# Altium schematic sheet Main_Schematic.SchDoc
size A2
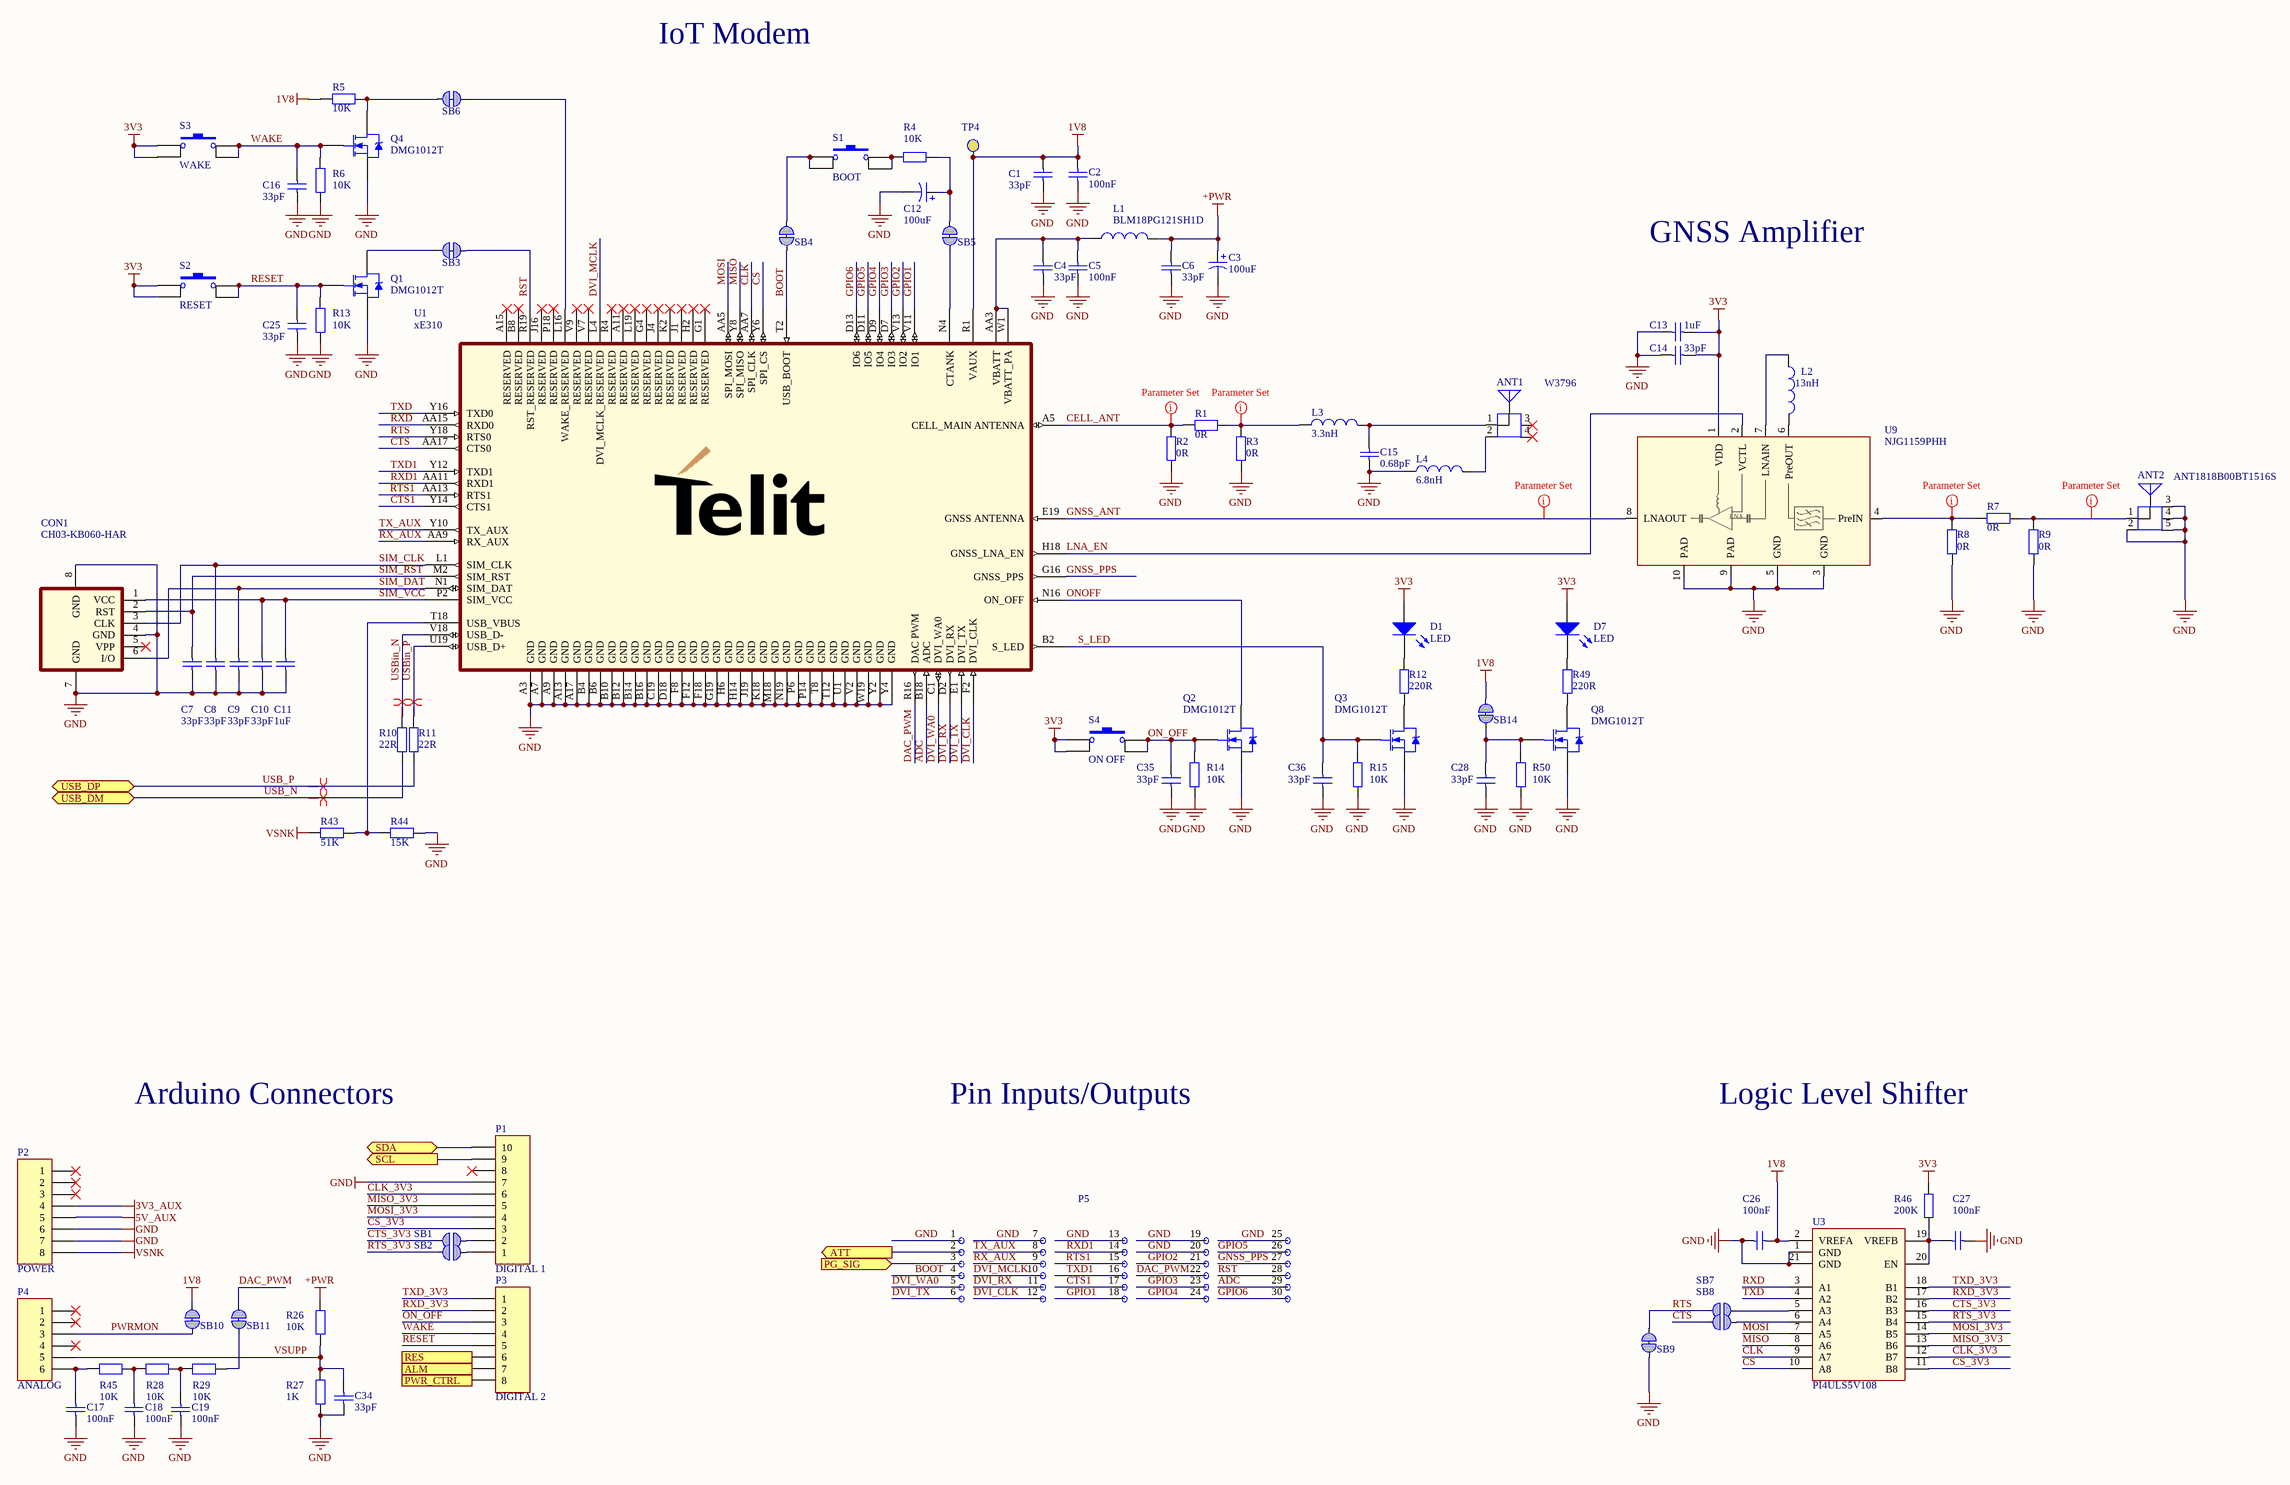
[diagram p0: Main_Schematic.SchDoc]

## Parts
ANT1  W3796  [W3796]
ANT2  ANT1818B00BT1516S  [ANT1818B00BT1516S]
C1  value 33pF  [C0402]  (hidden comment: Cap Semi)
C2  value 100nF  [C0402]  (hidden comment: Cap Semi)
C3  value 100uF  [Case-B]  (hidden comment: electrolytic capacitor)
C4  value 33pF  [C0402]  (hidden comment: Cap Semi)
C5  value 100nF  [C0402]  (hidden comment: Cap Semi)
C6  value 33pF  [C0402]  (hidden comment: Cap Semi)
C7  value 33pF  [C0402]  (hidden comment: Cap Semi)
C8  value 33pF  [C0402]  (hidden comment: Cap Semi)
C9  value 33pF  [C0402]  (hidden comment: Cap Semi)
C10  value 33pF  [C0402]  (hidden comment: Cap Semi)
C11  value 1uF  [C0402]  (hidden comment: Cap Semi)
C12  value 100uF  [Case-B]  (hidden comment: electrolytic capacitor)
C13  value 1uF  [C0402]  (hidden comment: Cap Semi)
C14  value 33pF  [C0402]  (hidden comment: Cap Semi)
C15  value 0.68pF  [C0402]  (hidden comment: Cap Semi)
C16  value 33pF  [C0402]  (hidden comment: Cap Semi)
C17  value 100nF  [C0402]  (hidden comment: Cap Semi)
C18  value 100nF  [C0402]  (hidden comment: Cap Semi)
C19  value 100nF  [C0402]  (hidden comment: Cap Semi)
C25  value 33pF  [C0402]  (hidden comment: Cap Semi)
C26  value 100nF  [C0402]  (hidden comment: Cap Semi)
C27  value 100nF  [C0402]  (hidden comment: Cap Semi)
C28  value 33pF  [C0402]  (hidden comment: Cap Semi)
C34  value 33pF  [C0402]  (hidden comment: Cap Semi)
C35  value 33pF  [C0402]  (hidden comment: Cap Semi)
C36  value 33pF  [C0402]  (hidden comment: Cap Semi)
CON1  CH03-KB060-HAR  [CH03-KB]
D1  LED  [PICOLED]
D7  LED  [PICOLED]
L1  value BLM18PG121SH1D  [L0603]  (hidden comment: Inductor)
L2  value 13nH  [L0402]  (hidden comment: Inductor)
L3  value 3.3nH  [L0603]  (hidden comment: Inductor)
L4  value 6.8nH  [L0603]  (hidden comment: Inductor)
P1  DIGITAL 1  [HDR1X10]
P2  POWER  [HDR1X8]  (no BOM)
P3  DIGITAL 2  [HDR1X8]  (no BOM)
P4  ANALOG  [HDR1X6]  (no BOM)
P5  THT_Matrix  [THT_Matrix_5x6]  (value not drawn)  (no BOM)
Q1  DMG1012T  [SOT-523_custom]
Q2  DMG1012T  [SOT-523_custom]
Q3  DMG1012T  [SOT-523_custom]
Q4  DMG1012T  [SOT-523_custom]
Q8  DMG1012T  [SOT-523_custom]
R1  value 0R  [R0402]  (hidden comment: Res2)
R2  value 0R  [R0402]  (hidden comment: Res2)
R3  value 0R  [R0402]  (hidden comment: Res2)
R4  value 10K  [R0402]  (hidden comment: Res2)
R5  value 10K  [R0402]  (hidden comment: Res2)
R6  value 10K  [R0402]  (hidden comment: Res2)
R7  value 0R  [R0402]  (hidden comment: Res2)
R8  value 0R  [R0402]  (hidden comment: Res2)
R9  value 0R  [R0402]  (hidden comment: Res2)
R10  value 22R  [R0402]  (hidden comment: Res2)
R11  value 22R  [R0402]  (hidden comment: Res2)
R12  value 220R  [R0402]  (hidden comment: Res2)
R13  value 10K  [R0402]  (hidden comment: Res2)
R14  value 10K  [R0402]  (hidden comment: Res2)
R15  value 10K  [R0402]  (hidden comment: Res2)
R26  value 10K  [R0402]  (hidden comment: Res2)
R27  value 1K  [R0402]  (hidden comment: Res2)
R28  value 10K  [R0402]  (hidden comment: Res2)
R29  value 10K  [R0402]  (hidden comment: Res2)
R43  value 51K  [R0402]  (hidden comment: Res2)
R44  value 15K  [R0402]  (hidden comment: Res2)
R45  value 10K  [R0402]  (hidden comment: Res2)
R46  value 200K  [R0402]  (hidden comment: Res2)
R49  value 220R  [R0402]  (hidden comment: Res2)
R50  value 10K  [R0402]  (hidden comment: Res2)
S1  BOOT  [EVPAA002K]
S2  RESET  [EVPAA002K]
S3  WAKE  [EVPAA002K]
S4  ON OFF  [EVQPUA]
SB1  Solderbridge  [Solderbridge]  (value not drawn)  (no BOM)
SB2  Solderbridge  [Solderbridge]  (value not drawn)  (no BOM)
SB3  Solderbridge  [Solderbridge_Shorted]  (value not drawn)  (net tie, no BOM)
SB4  Solderbridge  [Solderbridge_Shorted]  (value not drawn)  (net tie, no BOM)
SB5  Solderbridge  [Solderbridge_Shorted]  (value not drawn)  (net tie, no BOM)
SB6  Solderbridge  [Solderbridge_Shorted]  (value not drawn)  (net tie, no BOM)
SB7  Solderbridge  [Solderbridge]  (value not drawn)  (no BOM)
SB8  Solderbridge  [Solderbridge]  (value not drawn)  (no BOM)
SB9  Solderbridge  [Solderbridge_Shorted]  (value not drawn)  (net tie, no BOM)
SB10  Solderbridge  [Solderbridge_Shorted]  (value not drawn)  (net tie, no BOM)
SB11  Solderbridge  [Solderbridge_Shorted]  (value not drawn)  (net tie, no BOM)
SB14  Solderbridge  [Solderbridge_Shorted]  (value not drawn)  (net tie, no BOM)
TP4  Test_Point  [TEST_POINT]  (value not drawn)  (no BOM)
U1  xE310  [LGA_GE310]
U3  PI4ULS5V108  [VQFN-20]
U9  NJG1159PHH  [HFFP10-HH]

## Ports
ALM (out), ATT (out), PG_SIG (in), PWR_CTRL (out), RES (out), SCL (out), SDA (bidir), USB_DM (bidir), USB_DP (bidir)

## Nets
1V8: C1.1 C2.2 C26.2 R5.2 SB10.1 SB14.1 TP4.0 U1.R1(VAUX) U3.2(VREFA)
3V3: C13.1 C14.1 D1.1(A) D7.1(A) R46.2 S2.1 S2.4 S3.1 S3.4 S4.1 S4.3 U9.1(VDD)
3V3_AUX: P2.4
5V_AUX: P2.5
+PWR: C3.1 C6.2 L1.2 R26.2
GND: ANT2.2 ANT2.3 ANT2.4 ANT2.5 C1.2 C2.1 C3.2 C4.1 C5.1 C6.1 C7.2 C8.2 C9.2 C10.2 C11.1 C12.2 C13.2 C14.2 C15.2 C16.2 C17.2 C18.2 C19.2 C25.2 C26.1 C27.2 C28.2 C34.1 C35.2 C36.2 CON1.4(GND) CON1.7(GND) CON1.8(GND) L4.1 P1.7 P2.6 P2.7 P5.1 P5.7 P5.13 P5.19 P5.20 P5.25 Q1.3(S) Q2.3(S) Q3.3(S) Q4.3(S) Q8.3(S) R2.2 R3.2 R6.1 R8.2 R9.2 R13.1 R14.1 R15.1 R27.1 R44.1 R50.1 SB9.2 U1.A3(GND) U1.A7(GND) U1.A9(GND) U1.A13(GND) U1.A17(GND) U1.B4(GND) U1.B6(GND) U1.B10(GND) U1.B12(GND) U1.B14(GND) U1.B16(GND) U1.C19(GND) U1.D18(GND) U1.F8(GND) U1.F12(GND) U1.F18(GND) U1.G19(GND) U1.H6(GND) U1.H14(GND) U1.J19(GND) U1.K18(GND) U1.M18(GND) U1.N19(GND) U1.P6(GND) U1.P14(GND) U1.T8(GND) U1.T12(GND) U1.U1(GND) U1.V2(GND) U1.W19(GND) U1.Y2(GND) U1.Y4(GND) U3.1(GND) U3.21(GND) U9.3(GND) U9.5(GND) U9.9(PAD) U9.10(PAD)
VSNK: P2.8 R43.2
ADC: P5.29 U1.B18(ADC)
ALM: P3.7 ; port ALM
ATT: P5.2 ; port ATT
BOOT: P5.4 SB4.2 U1.T2(USB_BOOT)
CELL_ANT: R1.2 R2.1 U1.A5(CELL_MAIN_ANTENNA)
CLK: U1.AA7(SPI_CLK) U3.9(A7)
CLK_3V3: P1.6 U3.12(B7)
CS: U1.Y6(SPI_CS) U3.10(A8)
CS_3V3: P1.3 U3.11(B8)
CTS: SB8.1 U1.AA17(CTS0)
CTS1: P5.17 U1.Y14(CTS1)
CTS_3V3: SB1.1 U3.16(B3)
DAC_PWM: P5.22 SB11.1 U1.R16(DAC_PWM)
DVI_CLK: P5.12 U1.F2(DVI_CLK)
DVI_MCLK: P5.10 U1.L4(DVI_MCLK_RESERVED)
DVI_RX: P5.11 U1.D2(DVI_RX)
DVI_TX: P5.6 U1.E1(DVI_TX)
DVI_WA0: P5.5 U1.C1(DVI_WA0)
GNSS_ANT: U1.E19(GNSS_ANTENNA) U9.8(LNAOUT)
GNSS_PPS: P5.27 U1.G16(GNSS_PPS)
GPIO1: P5.18 U1.V11(IO1)
GPIO2: P5.21 U1.V13(IO2)
GPIO3: P5.23 U1.D7(IO3)
GPIO4: P5.24 U1.D9(IO4)
GPIO5: P5.26 U1.D11(IO5)
GPIO6: P5.30 U1.D13(IO6)
LNA_EN: U1.H18(GNSS_LNA_EN) U9.2(VCTL)
MISO: U1.Y8(SPI_MISO) U3.8(A6)
MISO_3V3: P1.5 U3.13(B6)
MOSI: U1.AA5(SPI_MOSI) U3.7(A5)
MOSI_3V3: P1.4 U3.14(B5)
ON_OFF: C35.1 P3.3 Q2.1(G) R14.2 S4.2 S4.4
ONOFF: Q2.2(D) U1.N16(ON_OFF)
PG_SIG: P5.3 ; port PG_SIG
PWR_CTRL: P3.8 ; port PWR_CTRL
PWRMON: P4.3 SB10.2
RES: P3.6 ; port RES
RESET: C25.1 P3.5 Q1.1(G) R13.2 S2.2 S2.3
RST: P5.28 SB3.1 U1.R19(RST_RESERVED)
RTS: SB7.1 SB9.1 U1.Y18(RTS0)
RTS1: P5.15 U1.AA13(RTS1)
RTS_3V3: SB2.1 U3.15(B4)
RX_AUX: P5.9 U1.AA9(RX_AUX)
RXD: U1.AA15(RXD0) U3.3(A1)
RXD1: P5.14 U1.AA11(RXD1)
RXD_3V3: P3.2 U3.17(B2)
S_LED: C36.1 Q3.1(G) R15.2 U1.B2(S_LED)
SCL: P1.9 ; port SCL
SDA: P1.10 ; port SDA
SIM_CLK: C8.1 CON1.3(CLK) U1.L1(SIM_CLK)
SIM_DAT: C9.1 CON1.6(I/O) U1.N1(SIM_DAT)
SIM_RST: C7.1 CON1.2(RST) U1.M2(SIM_RST)
SIM_VCC: C10.1 C11.2 CON1.1(VCC) U1.P2(SIM_VCC)
TX_AUX: P5.8 U1.Y10(TX_AUX)
TXD: U1.Y16(TXD0) U3.4(A2)
TXD1: P5.16 U1.Y12(TXD1)
TXD_3V3: P3.1 U3.18(B1)
USB_N: R10.1 ; port USB_DM
USB_P: R11.1 ; port USB_DP
USBin_N: R10.2 U1.V18(USB_D-)
USBin_P: R11.2 U1.U19(USB_D+)
VSUPP: C34.2 P4.5 R26.1 R27.2
WAKE: C16.1 P3.4 Q4.1(G) R6.2 S3.2 S3.3
NetANT1_1: ANT1.1 C15.1 L3.2
NetANT1_2: ANT1.2 L4.2
NetANT2_1: ANT2.1 R7.1 R9.1
NetC4_2: C4.2 C5.2 L1.1 U1.AA3(VBATT) U1.W1(VBATT_PA)
NetC12_1: C12.1 R4.1 SB5.1
NetC17_1: C17.1 P4.6 R45.2
NetC18_1: C18.1 R28.2 R45.1
NetC19_1: C19.1 R28.1 R29.2
NetC27_1: C27.1 R46.1 U3.19(VREFB) U3.20(EN)
NetC28_1: C28.1 Q8.1(G) R50.2 SB14.2
NetD1_2: D1.2(K) R12.1
NetD7_2: D7.2(K) R49.1
NetL2_1: L2.1 U9.7(LNAIN)
NetL2_2: L2.2 U9.6(PreOUT)
NetL3_1: L3.1 R1.1 R3.1
NetP1_1: P1.1 SB2.2
NetP1_2: P1.2 SB1.2
NetQ1_2: Q1.2(D) SB3.2
NetQ3_2: Q3.2(D) R12.2
NetQ4_2: Q4.2(D) R5.1 SB6.2
NetQ8_2: Q8.2(D) R49.2
NetR4_2: R4.2 S1.2 S1.3
NetR7_2: R7.2 R8.1 U9.4(PreIN)
NetR29_1: R29.1 SB11.2
NetR43_1: R43.1 R44.2 U1.T18(USB_VBUS)
NetS1_1: S1.1 S1.4 SB4.1
NetSB5_2: SB5.2 U1.N4(CTANK)
NetSB6_1: SB6.1 U1.L16(WAKE_RESERVED)
NetSB7_2: SB7.2 U3.5(A3)
NetSB8_2: SB8.2 U3.6(A4)

Not connected (* = marked no-connect by the designer): ANT1 3* 4*; CON1 5(VPP)*; P1 8*; P2 1* 2* 3*; P4 1* 2* 4*; U1 A11(RESERVED)* A15(RESERVED)* B8(RESERVED)* G1(RESERVED)* G4(RESERVED)* H2(RESERVED)* J1(RESERVED)* J4(RESERVED)* J16(RESERVED)* K2(RESERVED)* L19(RESERVED)* P18(RESERVED)* R4(RESERVED)* V7(RESERVED)* V9(RESERVED)*

## Layout directives
rule Clearance Constraint [Clearance = 0.2mm]; rule Width Constraint [Pref Width = 1.1mm    Min Width = 0.2mm    Max Width = 4mm]: CELL_ANT, GNSS_ANT, NetANT2_1, NetL3_1, NetR7_2
differential pair: USB_N, USB_P, USBin_N, USBin_P

## Notes on the sheet
- IoT Modem
- GNSS Amplifier
- Arduino Connectors
- Pin Inputs/Outputs
- Logic Level Shifter
- (in symbol NJG1159PHH) LNA

## Library data of the parts
ANT1 = Antenna: Generic Antenna; Manufacturer: Pulse; Part Description: LTE antenna; Specification: LTE; Manufacturer Part No.: W3796; Supplier: Rutronik; Supplier part number: WIREAC1998; Value: W3796; Link: https://www.pulselarsenantennas.com/product/w3796/
ANT2 = Antenna: Generic Antenna; Manufacturer: Yegeo; Part Description: GPS/Glonass Antenna; Specification: 1.575/1.602 GHz; Manufacturer Part No.: ANT1818B00BT1516S; Supplier: Rutronik; Supplier part number: WIREAC1868; Value: ANT1818B00BT1516S; Link: https://www.rutronik24.com/search-result/qs:ANT1818B00BT1516S/reset:0
C1 C4 C6-C10 C14 C16 C25 C28 C34-C36 = Cap Semi: Capacitor (Semiconductor SIM Model); Manufacturer: AVX; Manufacturer Part No.: 04025A330JAT2A; Part Description: Ceramic Capacitor; Specification: NP0, 50V, 5%; Supplier: Rutronik; Supplier part number: KKK13594; Link: https://www.rutronik24.com/product/avx/04025a330jat2a/3692730.html
C2 C5 C17-C19 C26 C27 = Cap Semi: Capacitor (Semiconductor SIM Model); Manufacturer: YAGEO; Manufacturer Part No.: CC0402KRX7R9BB104; Part Description: Ceramic Capacitor; Specification: X7R, 50V, 10%; Supplier: Rutronik; Supplier part number: KKK23619; Link: https://www.rutronik24.com/search-result/qs:KKK23619/reset:0
C3 C12 = Cap Pol1: Manufacturer: AVX; Manufacturer Part No.: TPSB107M006R0250; Part Description: Tantalum Capacitor; Specification: 6,3V 20%; Supplier: Rutronik; Supplier part number: TPSB107M006R0250; Link: https://www.rutronik24.com/search-result/qs:TPSB107M006R0250%20/reset:0
C11 C13 = Cap Semi: Capacitor (Semiconductor SIM Model); Manufacturer: muRata; Manufacturer Part No.: GRM155R61E105KA12D; Part Description: Ceramic Capacitor; Specification: X5R, 25V, 10%; Supplier: Rutronik; Supplier part number: KKS4987; Link: https://www.rutronik24.com/product/murata/grm155r61e105ka12d/4725132.html
C15 = Cap Semi: Capacitor (Semiconductor SIM Model); Manufacturer: YAGEO; Manufacturer Part No.: CC0402BRNPO9BNR68; Part Description: Ceramic Capacitor; Specification: NP0, 50V, 0.1pf; Supplier: Rutronik; Supplier part number: KKK18710; Link: https://www.rutronik24.com/category/ceramic-chip-commodity/case-size:0402/cn:0%252C68p/move:0
CON1 = CH03-KB060-HAR: Nano SIM Card Connector; Manufacturer: GradConn; Specification: Nano, 6 pins; Manufacturer Part No.: CH03-KB060-HAR; Supplier: Rutronik; Supplier part number: SIMCRD1002; Value: CH03-KB060-HAR; Part Description: Nano SIM Card Connector; Link: https://www.rutronik24.com/product/gradconn/ch03-kb060-har/7026333.html
D1 D7 = LED2: Typical SMD LED; Manufacturer: OSRAM; Manufacturer Part No.: LTQH9G-Q2OO-25-2Z4Y-5-R18; Specification: Green, 5mA; Value: LTQH9G-Q2OO-25-2Z4Y-5-R18; Supplier: Rutronik; Supplier part number: LED22816; Part Description: Typical SMD LED; Link: https://www.rutronik24.com/product/osram/ltqh9g-q2oo-25-2z4y-5-r18/7461152.html
L1 = Inductor: Manufacturer: muRata; Part Description: Ferrite Bead; Specification: 120R, 2A; Manufacturer Part No.: BLM18PG121SH1D; Supplier: Rutronik; Supplier part number: FE3867; Link: https://www.rutronik24.com/product/murata/blm18pg121sh1d/5885588.html
L2 = Inductor: Manufacturer: muRata; Manufacturer Part No.: LQW15AN13NG00D; Specification: 430mA, ±2%; Supplier: Rutronik; Supplier part number: LQW15AN13NG00D; Part Description: Inductor; Link: https://www.rutronik24.com/search-result/qs:%20LQW15AN13NG00D%20/reset:0
L3 = Inductor: Manufacturer: muRata; Manufacturer Part No.: LQG18HN3N3S00D; Specification: 500mA +/-0,3nH; Supplier: Rutronik; Supplier part number: IND5373; Part Description: Inductor; Link: https://www.rutronik24.com/search-result/qs:LQG18HN3N3S00D%20/reset:0
L4 = Inductor: Manufacturer: muRata; Manufacturer Part No.: LQW18AN6N8D10D; Specification: 900mA, ±0.5nH; Supplier: Rutronik; Supplier part number: LQW18AN6N8D10D; Part Description: Inductor; Link: https://www.rutronik24.com/search-result/qs:LQW18AN6N8D10D/reset:0
P1 = Header 10: Manufacturer: SparkFun Electronics; Manufacturer Part No.: PRT-11417; Part Description: Arduino Stackable Header Kit; Specification: 10 pos. 2,54mm; Value: PRT-11417; Supplier: Digi-Key; Supplier part number: 1568-1413-ND; Link: https://www.digikey.com/products/en?keywords=1568-1413-ND
P2 P3 = Header 8: Part Description: Arduino Connector; Specification: 8 pos. 2,54mm; Supplier: Rutronik
P4 = Header 6: Part Description: Arduino Connector; Specification: 6 pos. 2,54mm; Supplier: Rutronik
P5 = THT_Matrix: Pin matrix, 6 rows, 5 columns, 2.54mm pitch
Q1-Q4 Q8 = NMOS-2: N-Channel Power MOSFET; Manufacturer: Diodes Inc.; Manufacturer Part No.: DMG1012T-7; Part Description: N-Channel MOSFET; Specification: 20V, 0.63A; Value: DMG1012T-7; Supplier: Rutronik; Supplier part number: TMOSS6623; Link: https://www.rutronik24.com/product/diodes+inc/dmg1012t-7/5168665.html
R1-R3 R7-R9 = Res2: Manufacturer: YAGEO; Manufacturer Part No.: RC0402FR-070RL; Part Description: Thick Film Resistor; Specification: 5% 0,063W; Supplier: Rutronik; Supplier part number: WRC53079; Link: https://www.rutronik24.com/product/yageo/rc0402fr-070rl/5183530.html
R4-R6 R13-R15 R26 R28 R29 R45 R50 = Res2: Manufacturer: ASJ; Manufacturer Part No.: CR10-103-JK; Part Description: Thick Film Resistor; Specification: 5% 0,063W; Supplier: Rutronik; Supplier part number: WRC40976; Link: https://www.rutronik24.com/product/asj/cr10-103-jk/54295.html
R10 R11 = Res2: Manufacturer: ASJ; Manufacturer Part No.: CR10-220-JK; Part Description: Thick Film Resistor; Specification: 5% 0,063W; Supplier: Rutronik; Supplier part number: WRC34862; Link: https://www.rutronik24.com/product/asj/cr10-220-jk/51754.html
R12 R49 = Res2: Manufacturer: ASJ; Manufacturer Part No.: CR10-221-JK; Part Description: Thick Film Resistor; Specification: 5% 0,063W; Supplier: Rutronik; Supplier part number: WRC35108; Link: https://www.rutronik24.com/product/asj/cr10-221-jk/51883.html
R27 = Res2: Manufacturer: ASJ; Manufacturer Part No.: CR10-102-JK; Part Description: Thick Film Resistor; Specification: 5% 0,063W; Supplier: Rutronik; Supplier part number: WRC41426; Link: https://www.rutronik24.com/search-result/qs:CR10-102-JK/reset:0
R43 = Res2: Manufacturer: YAGEO; Manufacturer Part No.: RC0402JR-0751KL; Part Description: Thick Film Resistor; Specification: 5% 0,063W; Supplier: Rutronik; Supplier part number: WRC33877; Link: https://www.rutronik24.com/product/yageo/rc0402jr-0751kl/51045.html
R44 = Res2: Manufacturer: ASJ; Manufacturer Part No.: CR10-153-JK; Part Description: Thick Film Resistor; Specification: 5% 0,063W; Supplier: Rutronik; Supplier part number: WRC41435; Link: https://www.rutronik24.com/product/asj/cr10-153-jk/54400.html
R46 = Res2: Manufacturer: ASJ; Manufacturer Part No.: CR10-204-JK; Part Description: Thick Film Resistor; Specification: 5% 0,063W; Supplier: Rutronik; Supplier part number: WRC55047; Link: https://www.rutronik24.com/product/asj/cr10-204-jk/6641528.html
S1-S3 = EVPAA002K: Switch; Manufacturer: Panasonic; Part Description: Tactile Button; Specification: 1N, Straight , 20mA; Manufacturer Part No.: EVPAA002K; Supplier: Rutronik; Supplier part number: EVPAA002K; Value: EVPAA002K; Link: https://www.rutronik24.com/search-result/qs:EVPAA002K/reset:0
S4 = SW-PB: Switch; Manufacturer: Panasonic; Manufacturer Part No.: EVQPUJ02K; Part Description: Tactile Button; Specification: 1.6N, Right Angle, 50mA; Value: EVQPUJ02K; Supplier: Rutronik; Supplier part number: EVQPUJ02K; Link: https://www.rutronik24.com/search-result/qs:EVQPUJ02K/reset:0
SB3-SB6 SB9-SB11 SB14 = Solderbridge Shorted: Manufacturer: *; Value: Solderbridge; Supplier: *; Supplier part number: *
TP4 = Test_Point: Test Point
U1 = xE310-GNSS: xE310-GNSS IoT Modem; Manufacturer: Telit; Manufacturer Part No.: ME310G1-WW; Part Description: LTE M1/NB2 WW 2G/FB +GNSS; Specification: xE310 SMD LGA; Value: ME310G1-WW; Link: https://www.rutronik24.com/product/telit/mkt39902511798/13429520.html; Supplier: Rutronik; Supplier part number: GSM1995
U3 = PI4ULS5V108: 8-Bit Bi-directional Level Shifter for Open-Drain and Push-Pull Application; Manufacturer: Diodes Inc.; Part Description: 8-Bit Bi-direction Level Shifter; Specification: 5V, 8bit, 100MHz; Link: https://www.diodes.com/part/view/PI4ULS5V108; Manufacturer Part No.: PI4ULS5V108; Supplier: Rutronik; Supplier part number: PI4ULS5V108; Value: PI4ULS5V108
U9 = NJG1159PHH: GNSS Front-End Module; Manufacturer: New Japan Radio; Manufacturer Part No.: NJG1159PHH-TE1; Specification: 3.3V, 3.7mA; Value: NJG1159PHH-TE1; Link: https://www.rutronik24.com/search-result/qs:NJG1159PHH/reset:0; Part Description: GNSS Front-End Module; Supplier: Rutronik; Supplier part number: ICOP7179
SB1 SB2 SB7 SB8 = Solderbridge: Manufacturer: *; Value: Solderbridge; Supplier: *; Supplier part number: *